# Altium project VMA_SAUVC26.PrjPcb
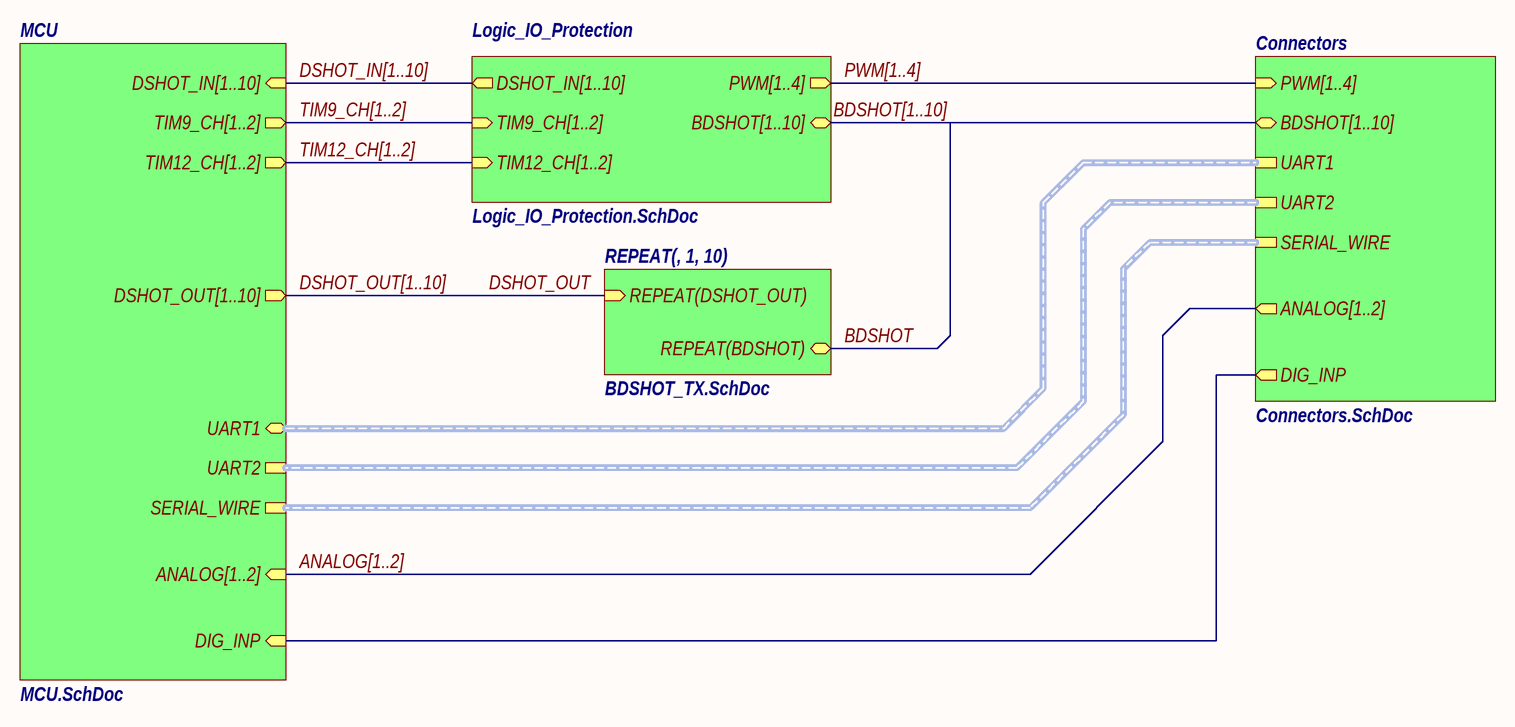
[diagram p0: Main.SchDoc]
CheckedBy: Карманов С; Decimal_Number_PCB: ГИДР.123456.012; Decimal_Number_Shematic: ГИДР.123456.013; DrawnBy: Михайловский Г.; Release_Date: 29.07.2025; Title: Плата ВМА; Version: 01
4 sheets, 78 parts. Net scope: hierarchical (ports join the sheet entries above them; power ports are global).
Board file: VMA_SAUVC26.PcbDoc
Sheets:
  Main.SchDoc
    MCU = MCU.SchDoc
    1 = BDSHOT_TX.SchDoc
    2 = BDSHOT_TX.SchDoc
    3 = BDSHOT_TX.SchDoc
    4 = BDSHOT_TX.SchDoc
    5 = BDSHOT_TX.SchDoc
    6 = BDSHOT_TX.SchDoc
    7 = BDSHOT_TX.SchDoc
    8 = BDSHOT_TX.SchDoc
    9 = BDSHOT_TX.SchDoc
    10 = BDSHOT_TX.SchDoc
    Logic_IO_Protection = Logic_IO_Protection.SchDoc

## Sheet Main.SchDoc: Плата ВМА
size 420 x 297 mm; SheetNumber: 1; SheetTotal: 5

### Sub-sheets
Connectors = Connectors.SchDoc (file not in this document): BDSHOT[1..10] (bidir), PWM[1..4] (in), UART1, UART2, SERIAL_WIRE, ANALOG[1..2] (out), DIG_INP (out)
Logic_IO_Protection = Logic_IO_Protection.SchDoc: DSHOT_IN[1..10] (out), TIM9_CH[1..2] (in), TIM12_CH[1..2] (in), BDSHOT[1..10] (bidir), PWM[1..4] (out)
MCU = MCU.SchDoc: DSHOT_IN[1..10] (in), DSHOT_OUT[1..10] (out), TIM9_CH[1..2] (out), TIM12_CH[1..2] (out), UART1 (bidir), UART2, SERIAL_WIRE, ANALOG[1..2] (in), DIG_INP (in)
REPEAT(, 1, 10) = BDSHOT_TX.SchDoc: REPEAT(DSHOT_OUT) (in), REPEAT(BDSHOT) (bidir)

### Nets
BDSHOT: sheet REPEAT(, 1, 10)/REPEAT(BDSHOT)
DIG_INP: sheet MCU/DIG_INP, sheet Connectors/DIG_INP
DSHOT_OUT: sheet REPEAT(, 1, 10)/REPEAT(DSHOT_OUT)

### Buses and harness runs
bus ANALOG[1..2] = sheet Connectors/ANALOG[1..2] = sheet MCU/ANALOG[1..2]
bus BDSHOT[1..10] = sheet Connectors/BDSHOT[1..10] = sheet Logic_IO_Protection/BDSHOT[1..10]
bus DSHOT_IN[1..10] = sheet Logic_IO_Protection/DSHOT_IN[1..10] = sheet MCU/DSHOT_IN[1..10]
bus DSHOT_OUT[1..10] = sheet MCU/DSHOT_OUT[1..10]
bus PWM[1..4] = sheet Connectors/PWM[1..4] = sheet Logic_IO_Protection/PWM[1..4]
bus TIM9_CH[1..2] = sheet Logic_IO_Protection/TIM9_CH[1..2] = sheet MCU/TIM9_CH[1..2]
bus TIM12_CH[1..2] = sheet Logic_IO_Protection/TIM12_CH[1..2] = sheet MCU/TIM12_CH[1..2]
harness sheet Connectors/SERIAL_WIRE = sheet MCU/SERIAL_WIRE
harness sheet Connectors/UART1 = sheet MCU/UART1
harness sheet Connectors/UART2 = sheet MCU/UART2

### Notes on the sheet
- Перв. примен.
- Справ. №
- Подп. и дата
- Инв. № дубл.
- Взам. инв. №
- Разраб.
- Изм.
- Лист
- № докум.
- Подп.
- Дата
- Лит.
- Масса
- Масштаб
- Пров.
- Т.контр.
- Схема электрическая принципиальная
- Листов
- Инв. № подл.
- Утв.
- Н.контр.
- Копировал
- Формат А3

## Sheet MCU.SchDoc: Плата ВМА
size 594 x 420 mm; SheetNumber: 2; SheetTotal: 5
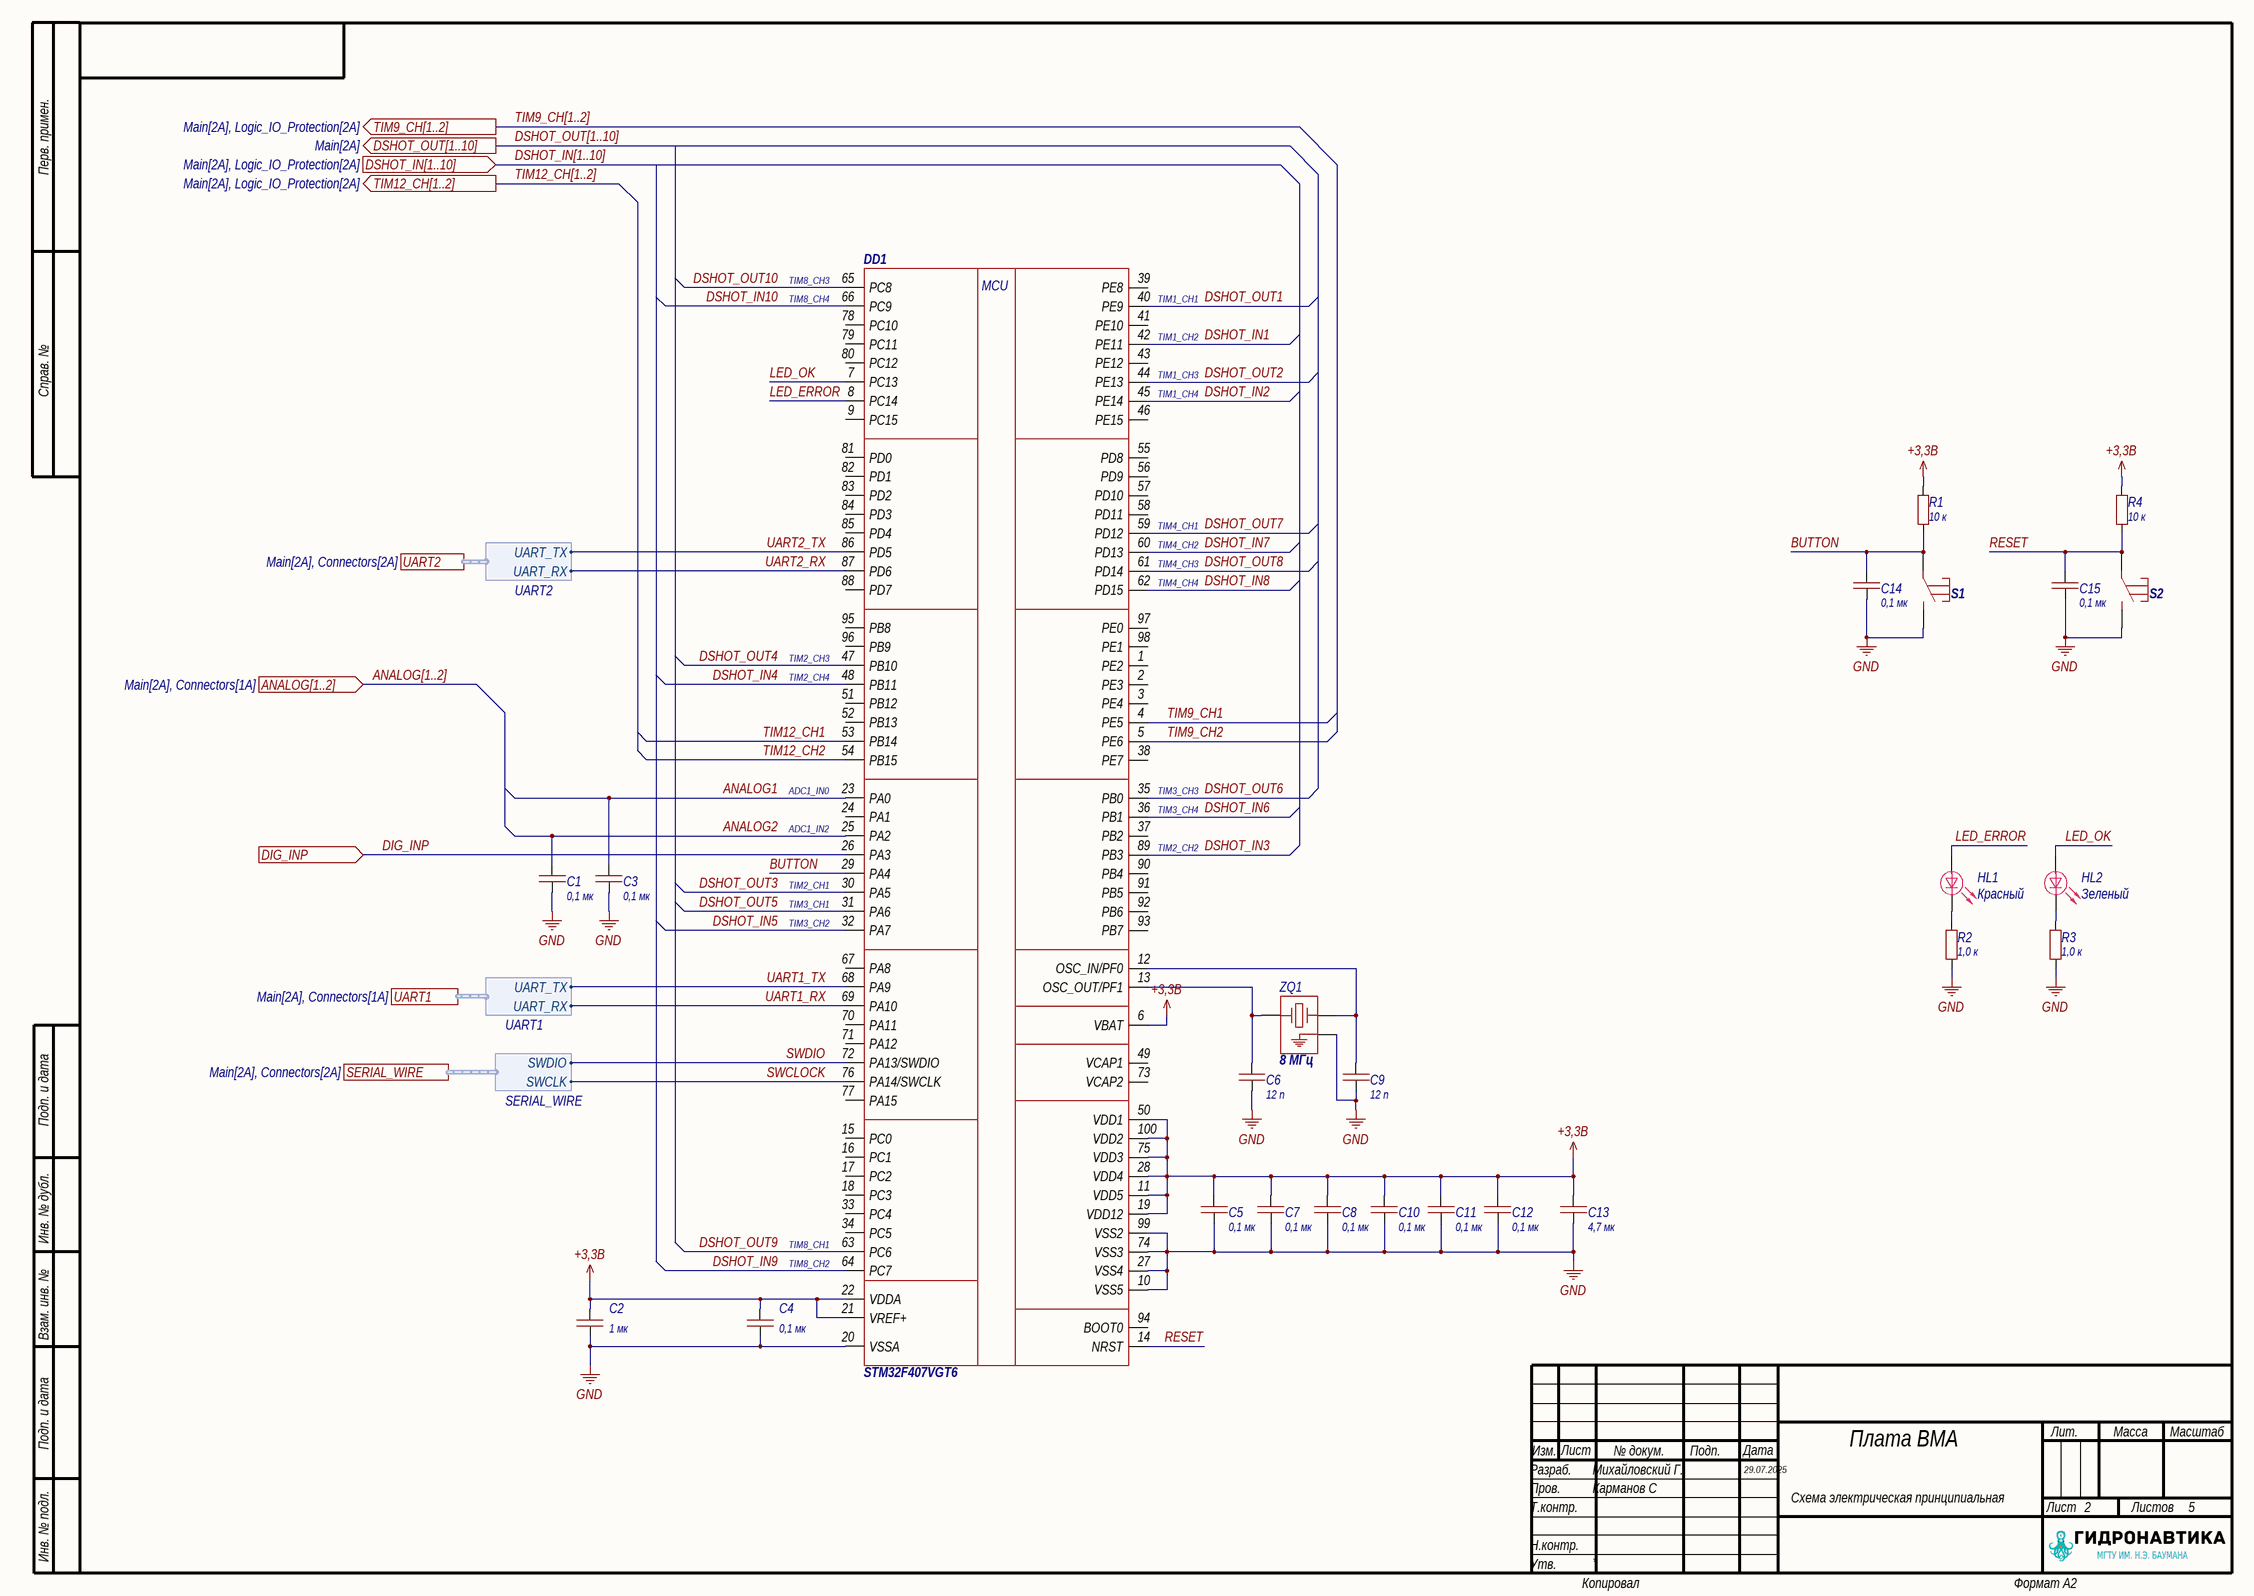
[diagram p1: MCU.SchDoc]

### Parts
C1  value 0,1 мк  [0603C]  (hidden comment: Capacitor)
C2  value 1 мк  [0603C]  (hidden comment: Capacitor)
C3  value 0,1 мк  [0603C]  (hidden comment: Capacitor)
C4  value 0,1 мк  [0603C]  (hidden comment: Capacitor)
C5  value 0,1 мк  [0603C]  (hidden comment: Capacitor)
C6  value 12 п  [0603C]  (hidden comment: Capacitor)
C7  value 0,1 мк  [0603C]  (hidden comment: Capacitor)
C8  value 0,1 мк  [0603C]  (hidden comment: Capacitor)
C9  value 12 п  [0603C]  (hidden comment: Capacitor)
C10  value 0,1 мк  [0603C]  (hidden comment: Capacitor)
C11  value 0,1 мк  [0603C]  (hidden comment: Capacitor)
C12  value 0,1 мк  [0603C]  (hidden comment: Capacitor)
C13  value 4,7 мк  [1206C]  (hidden comment: Capacitor)
C14  value 0,1 мк  [0603C]  (hidden comment: Capacitor)
C15  value 0,1 мк  [0603C]  (hidden comment: Capacitor)
DD1  STM32F407VGT6  [LQFP100]
HL1  Color: Красный  [0805D]  (hidden comment: LED)
HL2  Color: Зеленый  [0805D]  (hidden comment: LED)
R1  value 10 к  [0603R]  (hidden comment: Resistor)
R2  value 1,0 к  [0603R]  (hidden comment: Resistor)
R3  value 1,0 к  [0603R]  (hidden comment: Resistor)
R4  value 10 к  [0603R]  (hidden comment: Resistor)
S1  TSS-TD-19XA-XTR  [TSS-TD-19XA-XTR]  (value not drawn)
S2  TSS-TD-19XA-XTR  [TSS-TD-19XA-XTR]  (value not drawn)
ZQ1  value 8 МГц  [QSMD3.2x2.5]  (hidden comment: XTAL_GND)

### Ports
ANALOG[1..2] (in, see Main[2A], Connectors[1A]), DIG_INP (in), DSHOT_IN[1..10] (in, see Main[2A], Logic_IO_Protection[2A]), DSHOT_OUT[1..10] (out, see Main[2A]), SERIAL_WIRE (harness SERIAL_WIRE, see Main[2A], Connectors[2A]), TIM9_CH[1..2] (out, see Main[2A], Logic_IO_Protection[2A]), TIM12_CH[1..2] (out, see Main[2A], Logic_IO_Protection[2A]), UART1 (harness UART1, see Main[2A], Connectors[1A]), UART2 (harness UART2, see Main[2A], Connectors[2A])

### Harnesses
UART1: UART_TX, UART_RX
SERIAL_WIRE: SWDIO, SWCLK
UART2: UART_TX, UART_RX

### Nets
+3,3В: C2.2 C4.2 C5.2 C7.2 C8.2 C10.2 C11.2 C12.2 C13.2 DD1.6(VBAT) DD1.11(VDD5) DD1.19(VDD12) DD1.21(VREF+) DD1.22(VDDA) DD1.28(VDD4) DD1.50(VDD1) DD1.75(VDD3) DD1.100(VDD2) R1.2 R4.2
GND: C1.1 C2.1 C3.1 C4.1 C5.1 C6.1 C7.1 C8.1 C9.1 C10.1 C11.1 C12.1 C13.1 C14.1 C15.1 DD1.10(VSS5) DD1.20(VSSA) DD1.27(VSS4) DD1.74(VSS3) DD1.99(VSS2) R2.1 R3.1 S1.2 S2.2 ZQ1.3
ANALOG1: C3.2 DD1.23(PA0)
ANALOG2: C1.2 DD1.25(PA2)
BUTTON: C14.2 DD1.29(PA4) R1.1 S1.1
DIG_INP: DD1.26(PA3) ; port DIG_INP
DSHOT_IN1: DD1.42(PE11)
DSHOT_IN2: DD1.45(PE14)
DSHOT_IN3: DD1.89(PB3)
DSHOT_IN4: DD1.48(PB11)
DSHOT_IN5: DD1.32(PA7)
DSHOT_IN6: DD1.36(PB1)
DSHOT_IN7: DD1.60(PD13)
DSHOT_IN8: DD1.62(PD15)
DSHOT_IN9: DD1.64(PC7)
DSHOT_IN10: DD1.66(PC9)
DSHOT_OUT1: DD1.40(PE9)
DSHOT_OUT2: DD1.44(PE13)
DSHOT_OUT3: DD1.30(PA5)
DSHOT_OUT4: DD1.47(PB10)
DSHOT_OUT5: DD1.31(PA6)
DSHOT_OUT6: DD1.35(PB0)
DSHOT_OUT7: DD1.59(PD12)
DSHOT_OUT8: DD1.61(PD14)
DSHOT_OUT9: DD1.63(PC6)
DSHOT_OUT10: DD1.65(PC8)
LED_ERROR: DD1.8(PC14) HL1.1
LED_OK: DD1.7(PC13) HL2.1
RESET: C15.2 DD1.14(NRST) R4.1 S2.1
SWCLOCK: DD1.76(PA14/SWCLK) ; port SERIAL_WIRE.SWCLK
SWDIO: DD1.72(PA13/SWDIO) ; port SERIAL_WIRE.SWDIO
TIM9_CH1: DD1.4(PE5)
TIM9_CH2: DD1.5(PE6)
TIM12_CH1: DD1.53(PB14)
TIM12_CH2: DD1.54(PB15)
UART1_RX: DD1.69(PA10) ; port UART1.UART_RX
UART1_TX: DD1.68(PA9) ; port UART1.UART_TX
UART2_RX: DD1.87(PD6) ; port UART2.UART_RX
UART2_TX: DD1.86(PD5) ; port UART2.UART_TX
NetC6_2: C6.2 DD1.13(OSC_OUT/PF1) ZQ1.1
NetC9_2: C9.2 DD1.12(OSC_IN/PF0) ZQ1.2
NetHL1_2: HL1.2 R2.2
NetHL2_2: HL2.2 R3.2

Not connected (* = marked no-connect by the designer): DD1 1(PE2) 2(PE3) 3(PE4) 9(PC15) 15(PC0) 16(PC1) 17(PC2) 18(PC3) 24(PA1) 33(PC4) 34(PC5) 37(PB2) 38(PE7) 39(PE8) 41(PE10) 43(PE12) 46(PE15) 49(VCAP1) 51(PB12) 52(PB13) 55(PD8) 56(PD9) 57(PD10) 58(PD11) 67(PA8) 70(PA11) 71(PA12) 73(VCAP2) 77(PA15) 78(PC10) 79(PC11) 80(PC12) 81(PD0) 82(PD1) 83(PD2) 84(PD3) 85(PD4) 88(PD7) 90(PB4) 91(PB5) 92(PB6) 93(PB7) 94(BOOT0) 95(PB8) 96(PB9) 97(PE0) 98(PE1)

### Buses and harness runs
bus ANALOG[1..2] = port ANALOG[1..2]
bus DSHOT_IN[1..10] = port DSHOT_IN[1..10]
bus DSHOT_OUT[1..10] = port DSHOT_OUT[1..10]
bus TIM9_CH[1..2] = port TIM9_CH[1..2]
bus TIM12_CH[1..2] = port TIM12_CH[1..2]

### Notes on the sheet
- (near DD1) TIM8_CH3
- (near DD1) TIM8_CH4
- (near DD1) TIM1_CH1
- (near DD1) TIM1_CH2
- (near DD1) TIM1_CH3
- (near DD1) TIM1_CH4
- (near DD1) TIM4_CH1
- (near DD1) TIM4_CH2
- (near DD1) TIM4_CH3
- (near DD1) TIM4_CH4
- (near DD1) TIM2_CH3
- (near DD1) TIM2_CH4
- (near DD1) ADC1_IN0
- (near DD1) TIM3_CH3
- (near DD1) ADC1_IN2
- (near DD1) TIM3_CH4
- (near DD1) TIM2_CH1
- (near DD1) TIM2_CH2
- (near DD1) TIM3_CH1
- (near DD1) TIM3_CH2
- (near DD1) TIM8_CH1
- (near DD1) TIM8_CH2
- Перв. примен.
- Справ. №
- Подп. и дата
- Инв. № дубл.
- Взам. инв. №
- Разраб.
- Изм.
- Лист
- № докум.
- Подп.
- Дата
- Лит.
- Масса
- Масштаб
- Пров.
- Т.контр.
- Схема электрическая принципиальная
- Листов
- Инв. № подл.
- Утв.
- Н.контр.
- Копировал
- Формат А2
- (in symbol STM32F407VGT6) MCU

### Library data of the parts
C1 C3-C5 C7 C8 C10-C12 C14 C15 = Capacitor_0,1u_10_50V_X7R_0603C: Конденсатор; Library Path2: Schematic\Capacitor.SchLib; Tolerance: 0,1; Voltage (V): 50; Dielectric: X7R; Capacity (nF): 100; Part Number: Capacitor_0,1u_10_50V_X7R_0603C
C2 = Capacitor_1u_10_50V_X7R_0603C: Конденсатор; Library Path2: Schematic\Capacitor.SchLib; Tolerance: 0,1; Voltage (V): 50; Dielectric: X7R; Capacity (nF): 1000; Part Number: Capacitor_1u_10_50V_X7R_0603C
C6 C9 = 0,1 мк: Конденсатор 12п; Part Number: Capacitor
C13 = Capacitor_4,7u_10_50V_X7R_1206C: Конденсатор; Library Path2: Schematic\Capacitor.SchLib; Tolerance: 0,1; Voltage (V): 50; Dielectric: X7R; Capacity (nF): 4700; Part Number: Capacitor_4,7u_10_50V_X7R_1206C
DD1 = STM32F407VGT6: Микроконтроллер; Part Number: STM32F407VGT6
HL1 HL2 = LED: Светодиод; Part Number: LED
R1 R4 = Resistor_10k_1_0603: Резистор номиналом 10 кОм и точностью 1%; Power: *; Part Number: Resistor_10k_1_0603; Tolerance: 1%
R2 R3 = Resistor_1.0k_1_0603: Резистор номиналом 1,0 кОм и точностью 1%; Power: *; Part Number: Resistor_1.0k_1_0603; Tolerance: 1%
S1 S2 = TSS-TD-19XA-XTR: Тактовая кнопка; Part Number: TSS-TD-19XA-XTR
ZQ1 = XTAL_GND: Кварцевый резонатор с входом земли; Part Number: XTAL_GND

## Sheet BDSHOT_TX.SchDoc: Плата ВМА
size 420 x 297 mm; SheetNumber: 5; SheetTotal: 5
Used 10 times, as channels 1, 2, 3, 4, 5, 6, 7, 8, 9, 10. Parts and nets are listed once, with the designators drawn on the sheet.
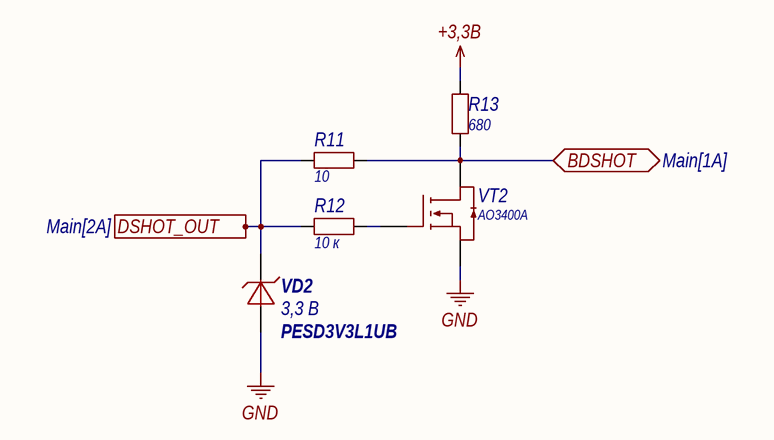
[diagram p2: BDSHOT_TX.SchDoc]

### Parts
R11  value 10  [0603R]  (hidden comment: Resistor)
R12  value 10 к  [0603R]  (hidden comment: Resistor)
R13  value 680  [0603R]  (hidden comment: Resistor)
VD2  PESD3V3L1UB  value 3,3 В  [SOD523]
VT2  AO3400A  [SOT23-3]

### Ports
BDSHOT (bidir, see Main[1A]), DSHOT_OUT (in, see Main[2A])

### Nets
+3,3В: R13.2
GND: VD2.1 VT2.2
BDSHOT: R11.2 R13.1 VT2.3 ; port BDSHOT
DSHOT_OUT: R11.1 R12.1 VD2.2 ; port DSHOT_OUT
NetR12_2: R12.2 VT2.1

### Channels
1: designators end in _1; ports BDSHOT=BDSHOT1 DSHOT_OUT=DSHOT_OUT1
2: designators end in _2; ports BDSHOT=BDSHOT2 DSHOT_OUT=DSHOT_OUT2
3: designators end in _3; ports BDSHOT=BDSHOT3 DSHOT_OUT=DSHOT_OUT3
4: designators end in _4; ports BDSHOT=BDSHOT4 DSHOT_OUT=DSHOT_OUT4
5: designators end in _5; ports BDSHOT=BDSHOT5 DSHOT_OUT=DSHOT_OUT5
6: designators end in _6; ports BDSHOT=BDSHOT6 DSHOT_OUT=DSHOT_OUT6
7: designators end in _7; ports BDSHOT=BDSHOT7 DSHOT_OUT=DSHOT_OUT7
8: designators end in _8; ports BDSHOT=BDSHOT8 DSHOT_OUT=DSHOT_OUT8
9: designators end in _9; ports BDSHOT=BDSHOT9 DSHOT_OUT=DSHOT_OUT9
10: designators end in _10; ports BDSHOT=BDSHOT10 DSHOT_OUT=DSHOT_OUT10

### Notes on the sheet
- Перв. примен.
- Справ. №
- Подп. и дата
- Инв. № дубл.
- Взам. инв. №
- Разраб.
- Изм.
- Лист
- № докум.
- Подп.
- Дата
- Лит.
- Масса
- Масштаб
- Пров.
- Т.контр.
- Схема электрическая принципиальная
- Листов
- Инв. № подл.
- Утв.
- Н.контр.
- Копировал
- Формат А3

### Library data of the parts
R11 = Resistor_10_1_0603: Резистор номиналом 10 Ом и точностью 1%; Power: *; Part Number: Resistor_10_1_0603; Tolerance: 1%
R12 = Resistor_10k_1_0603: Резистор номиналом 10 кОм и точностью 1%; Power: *; Part Number: Resistor_10k_1_0603; Tolerance: 1%
R13 = Resistor_680_1_0603: Резистор номиналом 680 Ом и точностью 1%; Power: *; Part Number: Resistor_680_1_0603; Tolerance: 1%
VD2 = PESD3V3L1UB: Защитный диод на 3,3 В, рассеиваемая мощность 45 Вт; Voltage nominal (V): 3,3; Power (W): 45; Part Number: PESD3V3L1UB
VT2 = AO3400A: N-канальный MOSFET; Part Number: AO3400A

## Sheet Logic_IO_Protection.SchDoc: Плата ВМА
size 420 x 297 mm; SheetNumber: 4; SheetTotal: 5
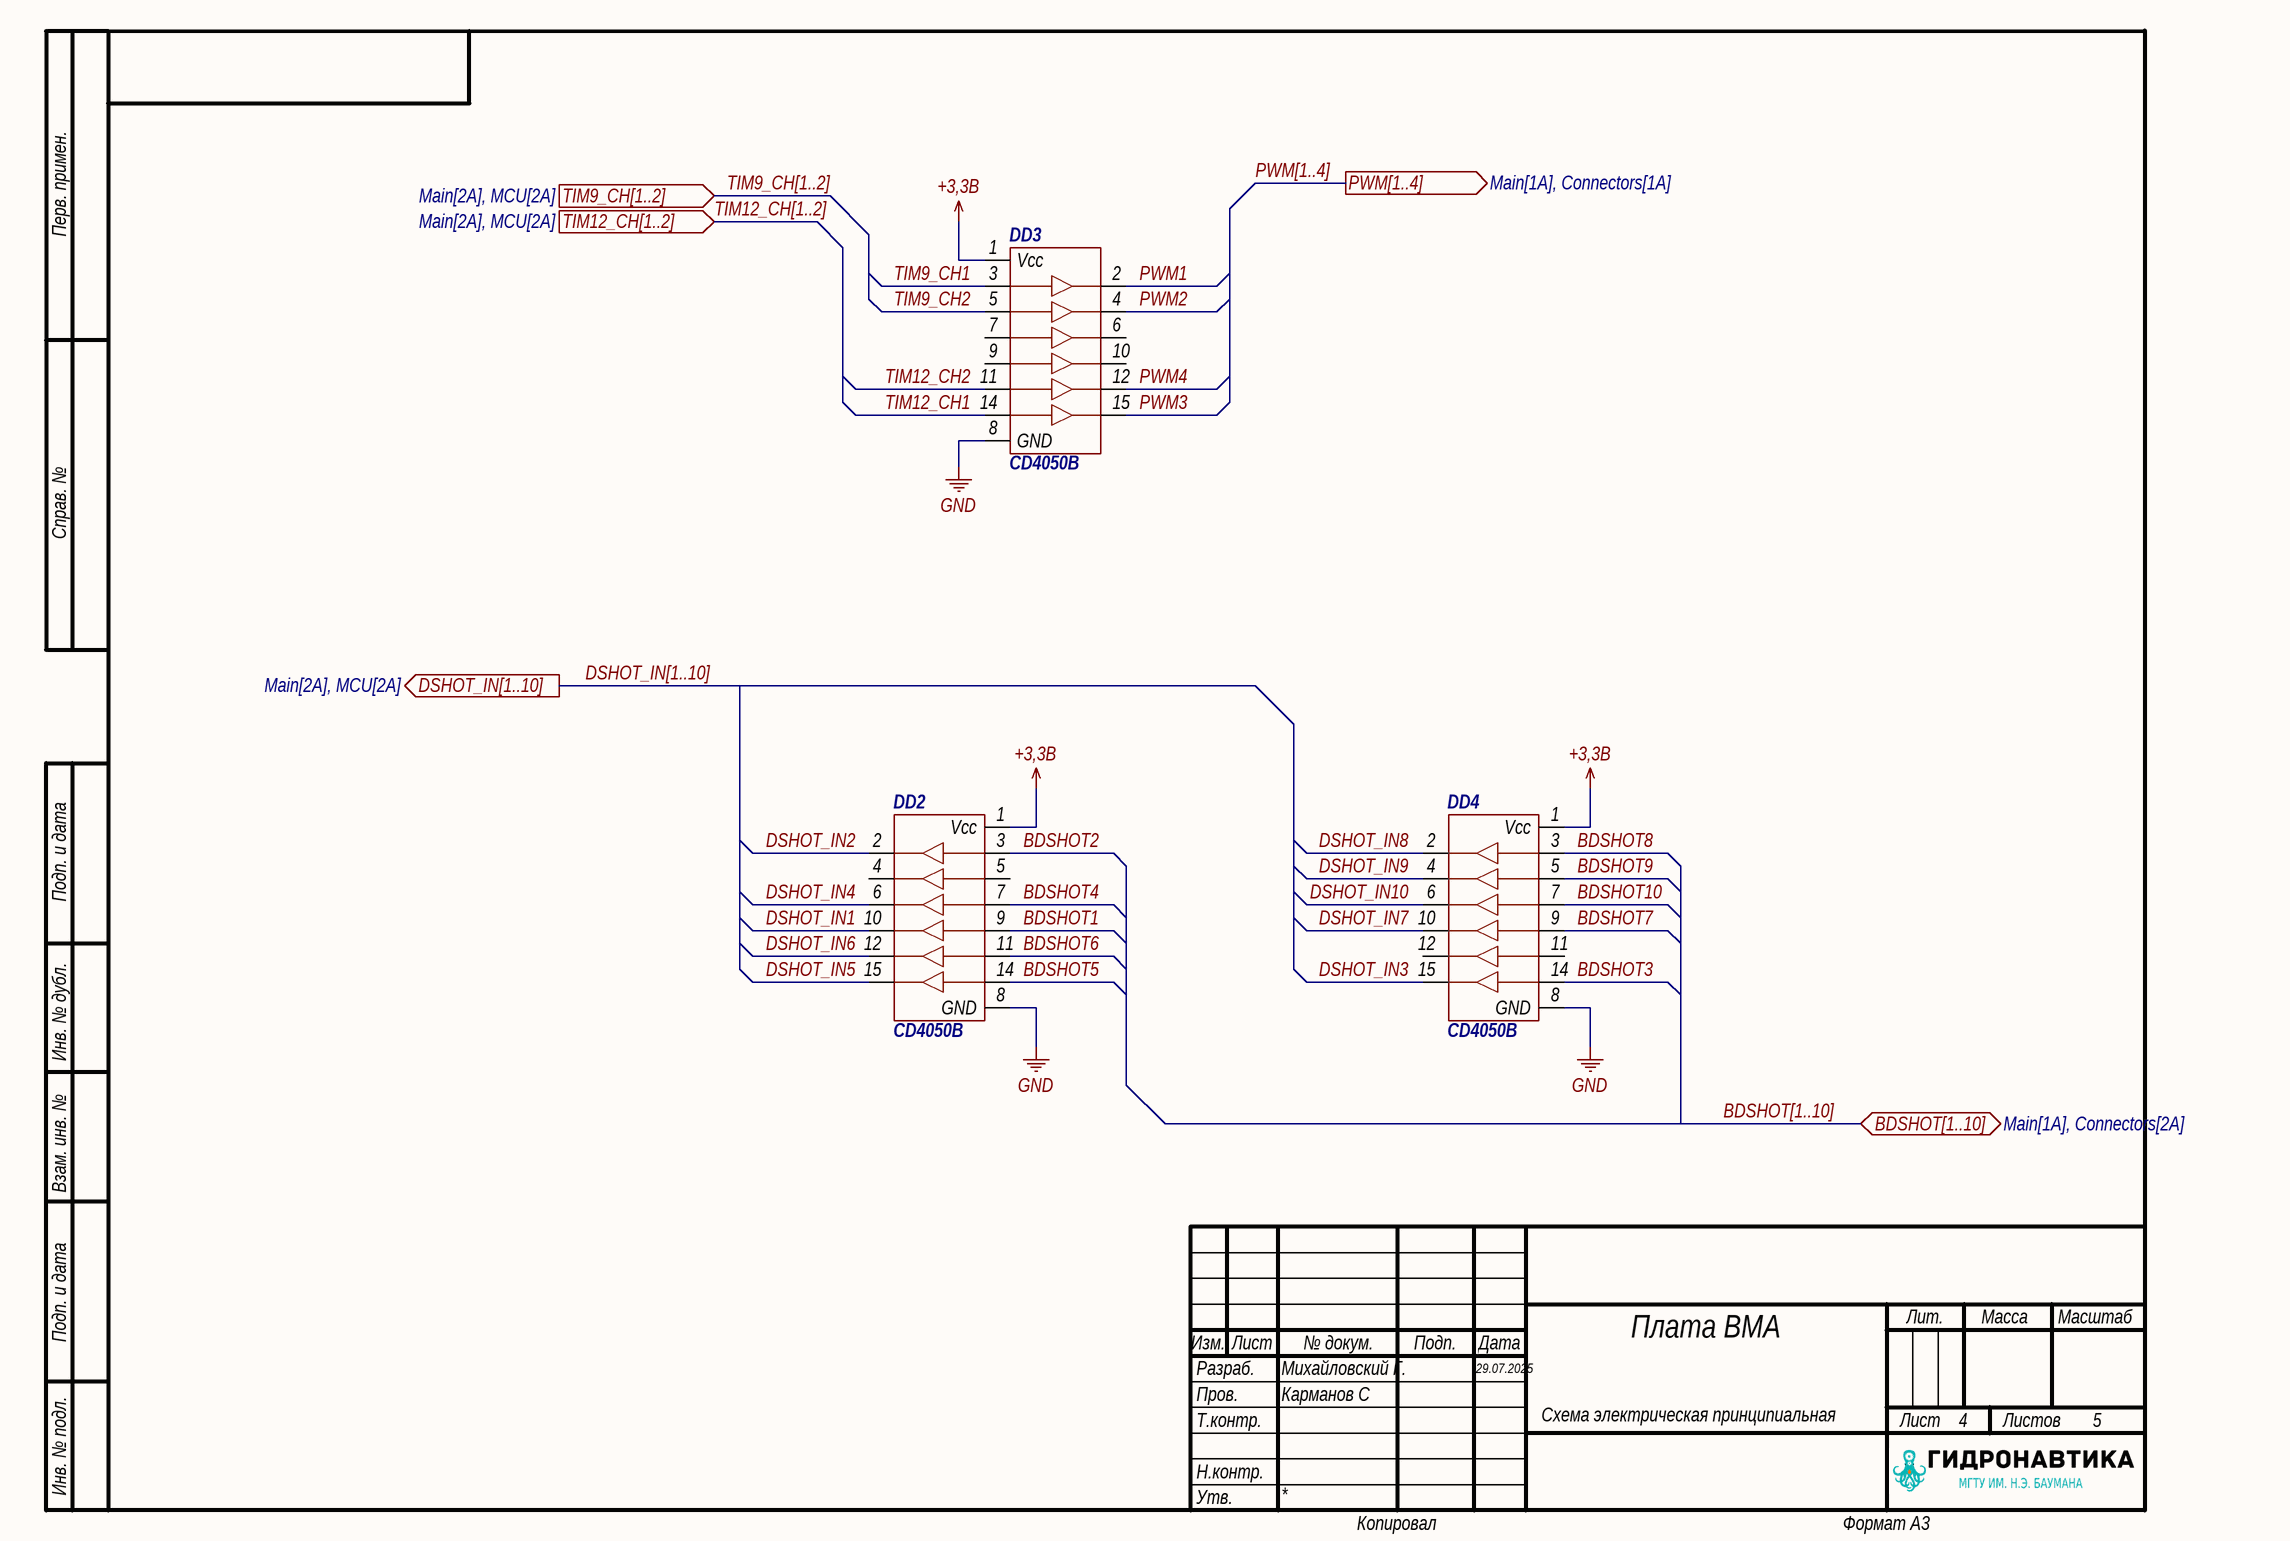
[diagram p3: Logic_IO_Protection.SchDoc]

### Parts
DD2  CD4050B  [SOIC-16]
DD3  CD4050B  [SOIC-16]
DD4  CD4050B  [SOIC-16]

### Ports
BDSHOT[1..10] (bidir, see Main[1A], Connectors[2A]), DSHOT_IN[1..10] (out, see Main[2A], MCU[2A]), PWM[1..4] (out, see Main[1A], Connectors[1A]), TIM9_CH[1..2] (in, see Main[2A], MCU[2A]), TIM12_CH[1..2] (in, see Main[2A], MCU[2A])

### Nets
+3,3В: DD2.1(Vcc) DD3.1(Vcc) DD4.1(Vcc)
GND: DD2.8(GND) DD3.8(GND) DD4.8(GND)
BDSHOT1: DD2.9(A4)
BDSHOT2: DD2.3(A1)
BDSHOT3: DD4.14(A6)
BDSHOT4: DD2.7(A3)
BDSHOT5: DD2.14(A6)
BDSHOT6: DD2.11(A5)
BDSHOT7: DD4.9(A4)
BDSHOT8: DD4.3(A1)
BDSHOT9: DD4.5(A2)
BDSHOT10: DD4.7(A3)
DSHOT_IN1: DD2.10(Y10)
DSHOT_IN2: DD2.2(Y1)
DSHOT_IN3: DD4.15(Y6)
DSHOT_IN4: DD2.6(Y3)
DSHOT_IN5: DD2.15(Y6)
DSHOT_IN6: DD2.12(Y5)
DSHOT_IN7: DD4.10(Y10)
DSHOT_IN8: DD4.2(Y1)
DSHOT_IN9: DD4.4(Y2)
DSHOT_IN10: DD4.6(Y3)
PWM1: DD3.2(Y1)
PWM2: DD3.4(Y2)
PWM3: DD3.15(Y6)
PWM4: DD3.12(Y5)
TIM9_CH1: DD3.3(A1)
TIM9_CH2: DD3.5(A2)
TIM12_CH1: DD3.14(A6)
TIM12_CH2: DD3.11(A5)

Not connected (* = marked no-connect by the designer): DD2 4(Y2) 5(A2); DD3 6(Y3) 7(A3) 9(A4) 10(Y10); DD4 11(A5) 12(Y5)

### Buses and harness runs
bus BDSHOT[1..10] = port BDSHOT[1..10]
bus DSHOT_IN[1..10] = port DSHOT_IN[1..10]
bus PWM[1..4] = port PWM[1..4]
bus TIM9_CH[1..2] = port TIM9_CH[1..2]
bus TIM12_CH[1..2] = port TIM12_CH[1..2]

### Notes on the sheet
- Перв. примен.
- Справ. №
- Подп. и дата
- Инв. № дубл.
- Взам. инв. №
- Разраб.
- Изм.
- Лист
- № докум.
- Подп.
- Дата
- Лит.
- Масса
- Масштаб
- Пров.
- Т.контр.
- Схема электрическая принципиальная
- Листов
- Инв. № подл.
- Утв.
- Н.контр.
- Копировал
- Формат А3

### Library data of the parts
DD2-DD4 = CD4050B: Шесть буферных элементов; Part Number: CD4050B

## Nets that join several sheets
+3,3В: MCU (20 pins), 1 (R13_1.2), 2 (R13_2.2), 3 (R13_3.2), 4 (R13_4.2), 5 (R13_5.2), 6 (R13_6.2), 7 (R13_7.2), 8 (R13_8.2), 9 (R13_9.2), 10 (R13_10.2), Logic_IO_Protection (DD2.1 DD3.1 DD4.1)
GND: MCU (25 pins), 1 (VD2_1.1 VT2_1.2), 2 (VD2_2.1 VT2_2.2), 3 (VD2_3.1 VT2_3.2), 4 (VD2_4.1 VT2_4.2), 5 (VD2_5.1 VT2_5.2), 6 (VD2_6.1 VT2_6.2), 7 (VD2_7.1 VT2_7.2), 8 (VD2_8.1 VT2_8.2), 9 (VD2_9.1 VT2_9.2), 10 (VD2_10.1 VT2_10.2), Logic_IO_Protection (DD2.8 DD3.8 DD4.8)
BDSHOT1: 1 (R11_1.2 R13_1.1 VT2_1.3), Logic_IO_Protection (DD2.9)
BDSHOT2: 2 (R11_2.2 R13_2.1 VT2_2.3), Logic_IO_Protection (DD2.3)
BDSHOT3: 3 (R11_3.2 R13_3.1 VT2_3.3), Logic_IO_Protection (DD4.14)
BDSHOT4: 4 (R11_4.2 R13_4.1 VT2_4.3), Logic_IO_Protection (DD2.7)
BDSHOT5: 5 (R11_5.2 R13_5.1 VT2_5.3), Logic_IO_Protection (DD2.14)
BDSHOT6: 6 (R11_6.2 R13_6.1 VT2_6.3), Logic_IO_Protection (DD2.11)
BDSHOT7: 7 (R11_7.2 R13_7.1 VT2_7.3), Logic_IO_Protection (DD4.9)
BDSHOT8: 8 (R11_8.2 R13_8.1 VT2_8.3), Logic_IO_Protection (DD4.3)
BDSHOT9: 9 (R11_9.2 R13_9.1 VT2_9.3), Logic_IO_Protection (DD4.5)
BDSHOT10: 10 (R11_10.2 R13_10.1 VT2_10.3), Logic_IO_Protection (DD4.7)
DSHOT_IN1: MCU (DD1.42), Logic_IO_Protection (DD2.10)
DSHOT_IN2: MCU (DD1.45), Logic_IO_Protection (DD2.2)
DSHOT_IN3: MCU (DD1.89), Logic_IO_Protection (DD4.15)
DSHOT_IN4: MCU (DD1.48), Logic_IO_Protection (DD2.6)
DSHOT_IN5: MCU (DD1.32), Logic_IO_Protection (DD2.15)
DSHOT_IN6: MCU (DD1.36), Logic_IO_Protection (DD2.12)
DSHOT_IN7: MCU (DD1.60), Logic_IO_Protection (DD4.10)
DSHOT_IN8: MCU (DD1.62), Logic_IO_Protection (DD4.2)
DSHOT_IN9: MCU (DD1.64), Logic_IO_Protection (DD4.4)
DSHOT_IN10: MCU (DD1.66), Logic_IO_Protection (DD4.6)
DSHOT_OUT1: MCU (DD1.40), 1 (R11_1.1 R12_1.1 VD2_1.2)
DSHOT_OUT2: MCU (DD1.44), 2 (R11_2.1 R12_2.1 VD2_2.2)
DSHOT_OUT3: MCU (DD1.30), 3 (R11_3.1 R12_3.1 VD2_3.2)
DSHOT_OUT4: MCU (DD1.47), 4 (R11_4.1 R12_4.1 VD2_4.2)
DSHOT_OUT5: MCU (DD1.31), 5 (R11_5.1 R12_5.1 VD2_5.2)
DSHOT_OUT6: MCU (DD1.35), 6 (R11_6.1 R12_6.1 VD2_6.2)
DSHOT_OUT7: MCU (DD1.59), 7 (R11_7.1 R12_7.1 VD2_7.2)
DSHOT_OUT8: MCU (DD1.61), 8 (R11_8.1 R12_8.1 VD2_8.2)
DSHOT_OUT9: MCU (DD1.63), 9 (R11_9.1 R12_9.1 VD2_9.2)
DSHOT_OUT10: MCU (DD1.65), 10 (R11_10.1 R12_10.1 VD2_10.2)
TIM9_CH1: MCU (DD1.4), Logic_IO_Protection (DD3.3)
TIM9_CH2: MCU (DD1.5), Logic_IO_Protection (DD3.5)
TIM12_CH1: MCU (DD1.53), Logic_IO_Protection (DD3.14)
TIM12_CH2: MCU (DD1.54), Logic_IO_Protection (DD3.11)

## Assembly variants
01: not fitted R11_d1 R11_d2 R11_d3 R11_d4 R11_d5 R11_d6 R11_d7 R11_d8 R11_d9 R11_d10 VD2_d1 VD2_d2 VD2_d3 VD2_d4 VD2_d5 VD2_d6 VD2_d7 VD2_d8 VD2_d9 VD2_d10
02: not fitted DD2 DD4 R12_d1 R12_d2 R12_d3 R12_d4 R12_d5 R12_d6 R12_d7 R12_d8 R12_d9 R12_d10 R13_d1 R13_d2 R13_d3 R13_d4 R13_d5 R13_d6 R13_d7 R13_d8 R13_d9 R13_d10 VT2_d1 VT2_d2 VT2_d3 VT2_d4 VT2_d5 VT2_d6 VT2_d7 VT2_d8 VT2_d9 VT2_d10